# EAGLE design ffc-breakout_v1 (EAGLE 8.3.1)
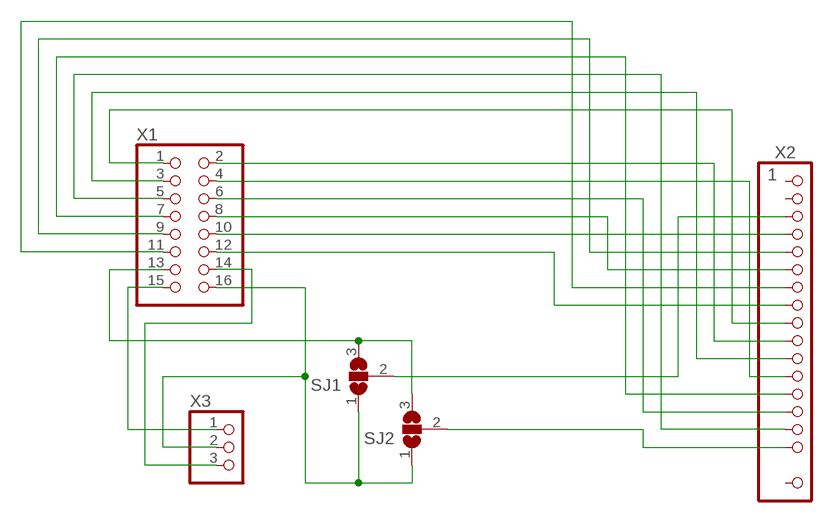
[diagram p0: schematic, sheet 1]

## Parts
SJ1  SJ2W  [SJ_2]
SJ2  SJ2W  [SJ_2]
X1  PINHD-2X8/90  [2X08/90]
X2  AMP_SFW16R-2STE1LF  [AMP_SFW16R-2STE1LF]
X3  PINHD-1X3/90  [1X03/90]

## Nets
N$1: SJ1.1 SJ2.1 X1.16 X3.2
N$2: X1.15 X3.1
N$3: SJ1.3 SJ2.3 X1.13
N$4: X1.14 X3.3
N$5: SJ1.2 X2.P$3
N$6: X1.1 X2.P$9
N$7: SJ2.2 X2.P$16
N$8: X1.2 X2.P$10
N$9: X1.3 X2.P$11
N$10: X1.4 X2.P$12
N$11: X1.5 X2.P$15
N$12: X1.6 X2.P$14
N$13: X1.7 X2.P$13
N$14: X1.8 X2.P$6
N$15: X1.9 X2.P$5
N$16: X1.10 X2.P$4
N$17: X1.11 X2.P$7
N$18: X1.12 X2.P$8
Unconnected: X2.P$1 X2.P$2 X2.PAD1 X2.PAD2

## Library data of the parts
SJ1 SJ2 = jumper:SJ2W: SMD solder JUMPER
X1 = pinhead:PINHD-2X8: PIN HEADER
X2 = components:AMP_SFW16R-2STE1LF
X3 = pinhead:PINHD-1X3: PIN HEADER

## Net classes
0 default: width 0.406 mm, drill 0.406 mm, clearance 0.203 mm

## Board
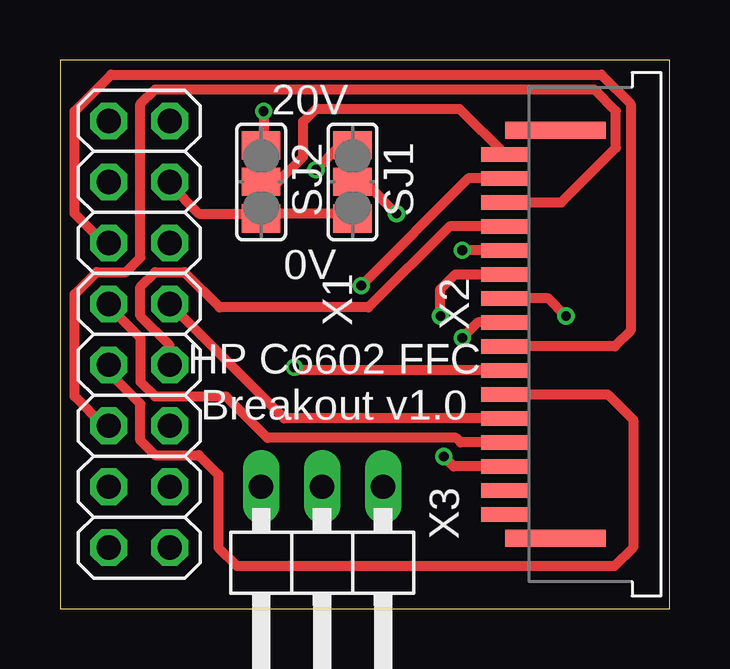
[diagram p1: board, top side]
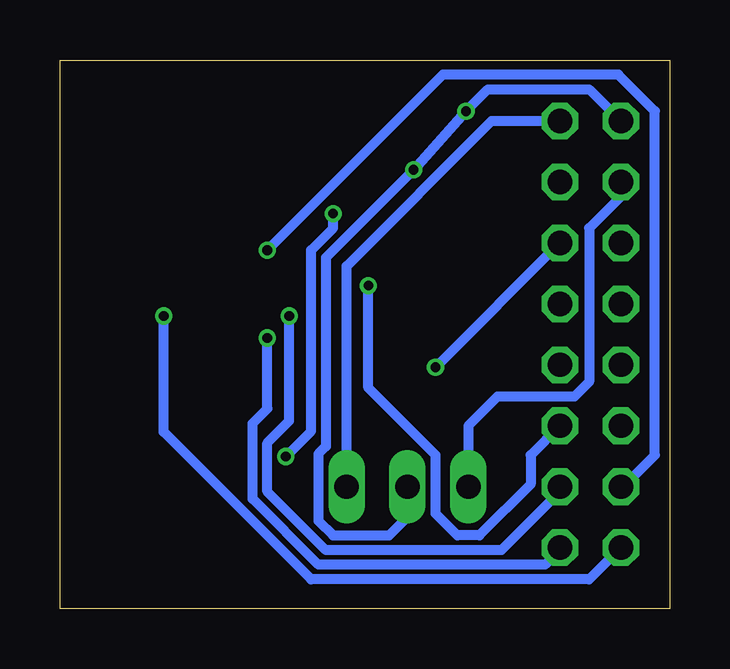
[diagram p2: board, bottom side, seen from below]

Size 25.4 x 22.86 mm. Coordinates in mm from the lower left corner, seen from the top.
Outline: 0,0 25.4,0 25.4,22.86 0,22.86 0,0
Copper layers (1*16): Top 0.035mm / dielectric 1.5mm / Bottom 0.035mm
Design rules "DirtyPCBs-2layer": minimum track width 5mil, minimum drill 12mil, track to track 5mil, track to pad 5mil, pad to pad 5mil, via to via 5mil, smd to smd 0mil, copper to edge 10mil, drill to drill 10mil, minimum pad ring 10mil, minimum via ring 6mil, stop-mask expansion 2mil, vias tented up to drill 25mil, thermal gap 10mil

### Footprints (pad centres in the part's own frame; a part is rotated, then mirrored left to right if it is on the bottom)
SJ_2 = smd 1.168 x 1.6: 1 -1.524,0; 2 0,0; 3 1.524,0
2X08 = drill 1.016 octagon: 1 -8.89,-1.27; 2 -8.89,1.27; 3 -6.35,-1.27; 4 -6.35,1.27; 5 -3.81,-1.27; 6 -3.81,1.27; 7 -1.27,-1.27; 8 -1.27,1.27; 9 1.27,-1.27; 10 1.27,1.27; 11 3.81,-1.27; 12 3.81,1.27; 13 6.35,-1.27; 14 6.35,1.27; 15 8.89,-1.27; 16 8.89,1.27
AMP_SFW16R-2STE1LF = smd 0.6 x 2: P$1 -7.5,0; P$2 -6.5,0; P$3 -5.5,0; P$4 -4.5,0; P$5 -3.5,0; P$6 -2.5,0; P$7 -1.5,0; P$8 -0.5,0; P$9 0.5,0; P$10 1.5,0; P$11 2.5,0; P$12 3.5,0; P$13 4.5,0; P$14 5.5,0; P$15 6.5,0; P$16 7.5,0 | smd 0.7 x 4.2: PAD1 -8.5,-2.1; PAD2 8.5,-2.1
1X03/90 = drill 1.016 long: 1 -2.54,-3.81; 2 0,-3.81; 3 2.54,-3.81

### Placement (x,y rotation side)
SJ1  12.19,17.78 270 top
SJ2  8.38,17.78 270 top
X1  [2X08]  3.3,11.43 90 top
X2  18.54,11.43 90 top
X3  10.92,1.27 180 top

### Tracks (layer width: path | path; a pad name or v marks a point on that pad's centre or on a via)
N$1  (via drill 0.41)
  Top 0.406: v10.67,18.29 11.58,19.2 12.19,19.2 SJ1.1 | v8.48,20.73 8.48,19.41 SJ2.1
  Bottom 0.406: X1.16 3.35,21.64 7.57,21.64 v8.48,20.73 v10.67,18.29 14.33,14.63 14.33,6.76 14.63,6.45 14.63,3.66 14.02,3.05 11.68,3.05 10.92,3.81 X3.2
N$2
  Bottom 0.406: X3.1 13.46,14.28 7.42,20.32 X1.15
N$3
  Top 0.406: SJ1.3 12.19,16.46 8.53,16.46 SJ2.3 8.23,16.46 5.79,16.46 4.57,17.68 X1.13
N$4
  Bottom 0.406: X3.3 8.38,7.62 7.16,8.84 3.96,8.84 3.35,9.45 3.35,15.85 2.03,17.17 X1.14
N$5  (via drill 0.41)
  Top 0.406: v14.02,16.46 12.8,17.68 12.19,17.68 SJ1.2 | X2.P$3 16.4,5.93 v15.99,6.34
  Bottom 0.406: v14.02,16.46 14.02,15.85 14.94,14.94 14.94,7.39 v15.99,6.34
N$6  (via drill 0.41)
  Top 0.406: X2.P$9 17.42,11.93 v16.76,11.28
  Bottom 0.406: v16.76,11.28 16.76,8.33 17.37,7.72 17.37,4.57 14.63,1.83 5.18,1.83 4.57,2.44 X1.1
N$7
  Top 0.406: SJ2.2 9.08,17.78 10.13,18.83 10.13,20.29 10.67,20.83 16.64,20.83 X2.P$16
N$8  (via drill 0.41)
  Top 0.406: v21.08,12.19 20.34,12.93 X2.P$10
  Bottom 0.406: X1.2 3.35,1.22 14.94,1.22 21.08,7.37 v21.08,12.19
N$9  (via drill 0.41)
  Top 0.406: X2.P$11 16.47,13.93 15.85,13.31 v15.85,12.19
  Bottom 0.406: v15.85,12.19 15.85,7.82 16.76,6.91 16.76,4.88 14.33,2.44 7.01,2.44 4.57,4.88 X1.3
N$10  (via drill 0.41)
  Top 0.406: X2.P$12 v16.77,14.93 v16.76,14.94
  Bottom 0.406: v16.76,14.94 9.45,22.25 2.13,22.25 0.61,20.73 0.61,6.4 1.83,5.18 X1.4
N$11  (via drill 0.41)
  Top 0.406: X2.P$15 17.02,17.93 v12.55,13.46
  Bottom 0.406: v12.55,13.46 12.55,9.2 9.75,6.4 9.75,3.96 8.84,3.05 7.92,3.05 5.79,5.18 5.79,6.4 X1.5
N$12
  Top 0.406: X1.6 1.83,7.62 0.61,8.84 0.61,13.11 1.52,14.02 2.74,14.02 3.35,14.63 3.35,21.03 3.96,21.64 22.25,21.64 23.16,20.73 23.16,19.2 20.89,16.93 X2.P$14
N$13
  Top 0.406: X1.7 4.57,10.97 3.35,12.19 3.35,13.41 3.96,14.02 5.18,14.02 6.66,12.55 12.85,12.55 16.23,15.93 X2.P$13
N$14
  Top 0.406: X2.P$6 22.82,8.93 23.88,7.87 23.88,2.54 23.11,1.78 7.37,1.78 6.6,2.54 6.6,5.59 5.79,6.4 3.96,6.4 3.35,7.01 3.35,8.53 2.03,9.86 X1.8
N$15
  Top 0.406: X2.P$5 9.34,7.93 X1.9
N$16
  Top 0.406: X1.10 2.03,12.6 3.35,11.28 3.35,9.45 3.96,8.84 6.91,8.84 8.64,7.11 16.51,7.11 16.69,6.93 X2.P$4
N$17  (via drill 0.41)
  Top 0.406: X2.P$7 9.88,9.93 v9.75,10.06
  Bottom 0.406: X1.11 v9.75,10.06
N$18
  Top 0.406: X1.12 1.83,15.24 0.61,16.46 0.61,20.73 2.13,22.25 22.55,22.25 23.77,21.03 23.77,11.58 23.12,10.93 X2.P$8

### Text on the board
tPlace: 20V | 0V | HP C6602 FFC / Breakout v1.0